# EAGLE design RGB (EAGLE 8.2.2)
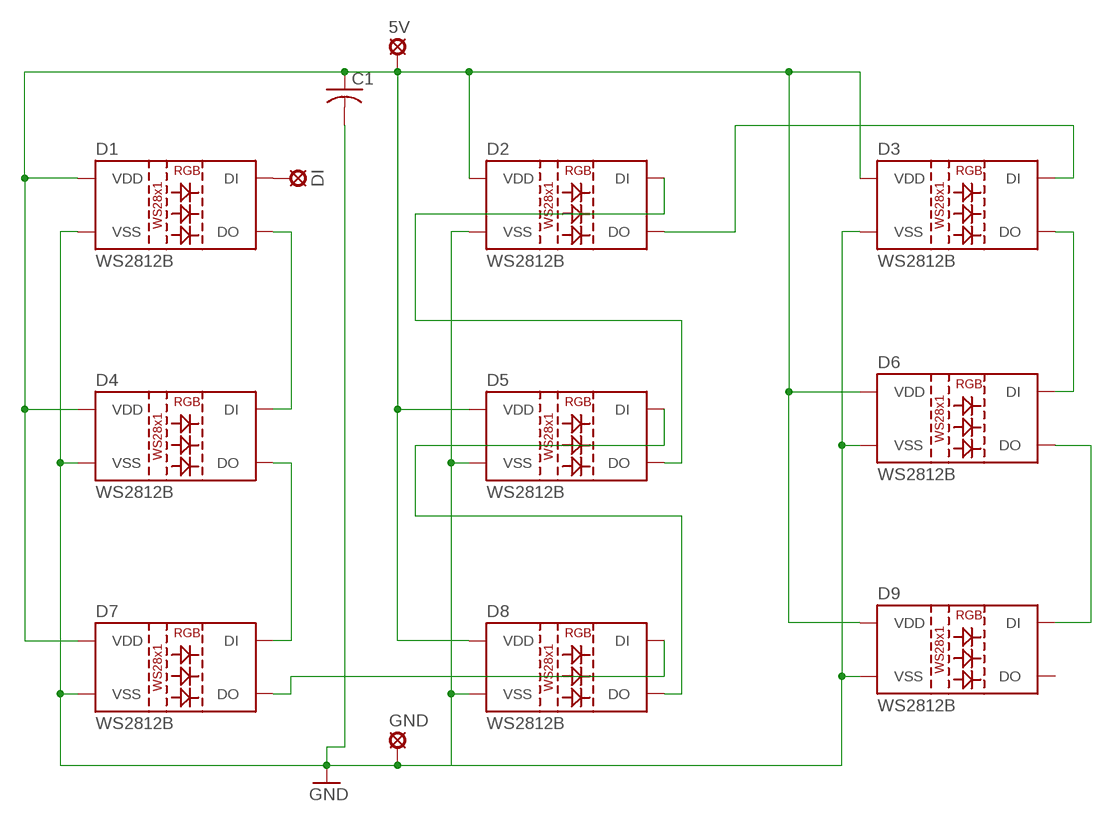
[diagram p0: schematic, sheet 1]

## Parts
5V  LSP11  [LSP11]
C1  C-USC0805K  [C0805K]
D1  WS2812B  [WS2812B]
D2  WS2812B  [WS2812B]
D3  WS2812B  [WS2812B]
D4  WS2812B  [WS2812B]
D5  WS2812B  [WS2812B]
D6  WS2812B  [WS2812B]
D7  WS2812B  [WS2812B]
D8  WS2812B  [WS2812B]
D9  WS2812B  [WS2812B]
DI  LSP11  [LSP11]
GND  LSP11  [LSP11]

## Nets
GND: C1.2 D1.3(VSS) D2.3(VSS) D3.3(VSS) D4.3(VSS) D5.3(VSS) D6.3(VSS) D7.3(VSS) D8.3(VSS) D9.3(VSS) GND.MP
N$3: 5V.MP C1.1 D1.1(VDD) D2.1(VDD) D3.1(VDD) D4.1(VDD) D5.1(VDD) D6.1(VDD) D7.1(VDD) D8.1(VDD) D9.1(VDD)
N$5: D1.2(DO) D4.4(DI)
N$6: D4.2(DO) D7.4(DI)
N$7: D7.2(DO) D8.4(DI)
N$8: D5.4(DI) D8.2(DO)
N$9: D2.4(DI) D5.2(DO)
N$10: D2.2(DO) D3.4(DI)
N$11: D3.2(DO) D6.4(DI)
N$12: D6.2(DO) D9.4(DI)
N$13: D1.4(DI) DI.MP
Unconnected: D9.2(DO)

## Library data of the parts
5V DI GND = solpad:LSP11: SOLDER PAD drill 1.1 mm
C1 = adafruit:C-US: CAPACITOR, American symbol
D1-D9 = SparkFun-LED:WS2812B: WS2812B SMD addressable RGB LED 5x5mm SMD LED with built-in controller IC. Color: Red/Green/Blue mC Rating: RGB: 390, 660, 180 mcd Forward Voltage: RGB: 2.0, 3.0, 3.0 V Packages:WS2812B SparkFun Products: Blynk Board - ESP8266 <https://www.sparkfun.com/products/13794>; PROD_ID: DIO-12503

## Net classes
0 default: clearance 0.381 mm

## Board
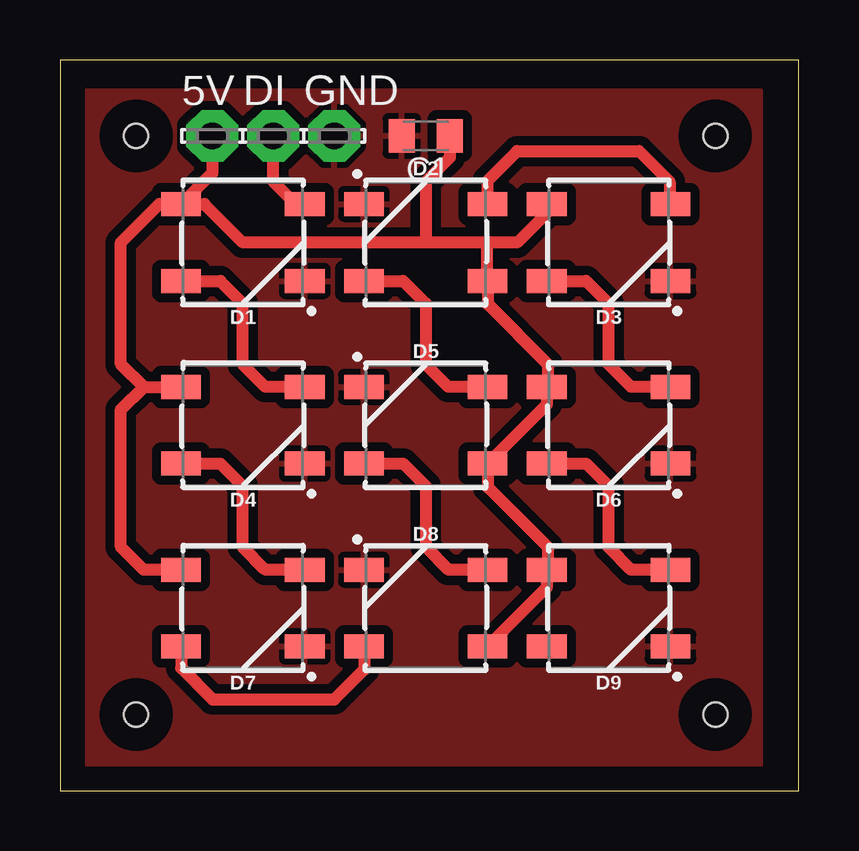
[diagram p1: board, top side]

Size 30.79 x 30.47 mm. Coordinates in mm from the lower left corner, seen from the top.
Outline: 0,0 30.79,0 30.79,30.47 0,30.47 0,0
Copper layers (1*16): Top 0.035mm / dielectric 1.5mm / Bottom 0.035mm
Design rules "default": minimum track width 6mil, minimum drill 0.35mm, track to track 6mil, track to pad 6mil, pad to pad 6mil, via to via 6mil, smd to smd 6mil, copper to edge 40mil, drill to drill 6mil, minimum pad ring 10mil, minimum via ring 8mil, stop-mask expansion 4mil, vias tented up to drill 0mil, thermal gap 10mil
Holes 1 mm at 3.17,27.3 3.17,3.17 27.3,3.17 27.3,27.3

### Footprints (pad centres in the part's own frame; a part is rotated, then mirrored left to right if it is on the bottom)
LSP11 = drill 1.118 pad 2.159 octagon: MP 0,0
C0805K = smd 1.1 x 1.4: 1 -1,0; 2 1,0
WS2812B = smd 1.651 x 1: 1 2.577,-1.6; 2 2.577,1.6; 3 -2.577,1.6; 4 -2.577,-1.6

### Placement (x,y rotation side)
5V  6.35,27.3 0 top
C1  15.24,27.3 180 top
D1  7.62,22.86 180 top
D2  15.24,22.86 0 top
D3  22.86,22.86 180 top
D4  7.62,15.24 180 top
D5  15.24,15.24 0 top
D6  22.86,15.24 180 top
D7  7.62,7.62 180 top
D8  15.24,7.62 0 top
D9  22.86,7.62 180 top
DI  8.89,27.3 0 top
GND  11.43,27.3 0 top

### Tracks (layer width: path | path; a pad name or v marks a point on that pad's centre or on a via)
GND
  pour Top: 0,29.21 0,0 29.21,0 29.21,29.21
N$3
  Top 0.508: 15.24,22.86 15.24,25.4 16.24,26.4 C1.1 | 5V.MP 6.35,25.77 D1.1 | D1.1 4.14,24.46 2.54,22.86 2.54,17.78 3.48,16.84 | 3.48,16.84 D4.1 | D7.1 3.48,9.22 2.54,10.16 2.54,15.9 3.48,16.84 | D1.1 6.02,24.46 7.62,22.86 15.24,22.86 | 17.78,22.86 15.24,22.86 | 17.78,22.86 17.78,21.3 D2.1 17.82,20.28 20.32,17.78 20.32,16.88 D6.1 20.28,16.11 D5.1 17.82,12.66 20.32,10.16 20.32,9.26 D9.1 20.28,8.49 D8.1 | 20.32,24.42 D3.1 20.28,24.09 19.05,22.86 17.78,22.86
N$5
  Top 0.508: D1.2 6.68,21.26 7.62,20.32 7.62,17.78 8.56,16.84 D4.4
N$6
  Top 0.508: D4.2 6.68,13.64 7.62,12.7 7.62,10.16 8.56,9.22 D7.4
N$7
  Top 0.508: D7.2 5.04,5.12 6.35,3.81 11.43,3.81 12.7,5.08 12.7,5.98 D8.4
N$8
  Top 0.508: D8.2 16.18,9.22 15.24,10.16 15.24,12.7 14.3,13.64 D5.4
N$9
  Top 0.508: D5.2 16.18,16.84 15.24,17.78 15.24,20.32 14.3,21.26 D2.4
N$10
  Top 0.508: D2.2 17.82,25.44 19.05,26.67 24.13,26.67 25.4,25.4 25.4,24.5 D3.4
N$11
  Top 0.508: D3.2 21.92,21.26 22.86,20.32 22.86,17.78 23.8,16.84 D6.4
N$12
  Top 0.508: D6.2 21.92,13.64 22.86,12.7 22.86,10.16 23.8,9.22 D9.4
N$13
  Top 0.508: D1.4 9.83,24.46 8.89,25.4 DI.MP